# EasyEDA Pro project PicoDucky.epro

# Schematic PicoDucky
Board Name: Board1; Create Date: 2025-05-18; Page Name: P1; Project Name: PicoDucky_V2.0; Schematic Name: PicoDucky; Update Date: 2025-05-29; Company: EasyEDA.com; Page Size: A4; Version: V1.0
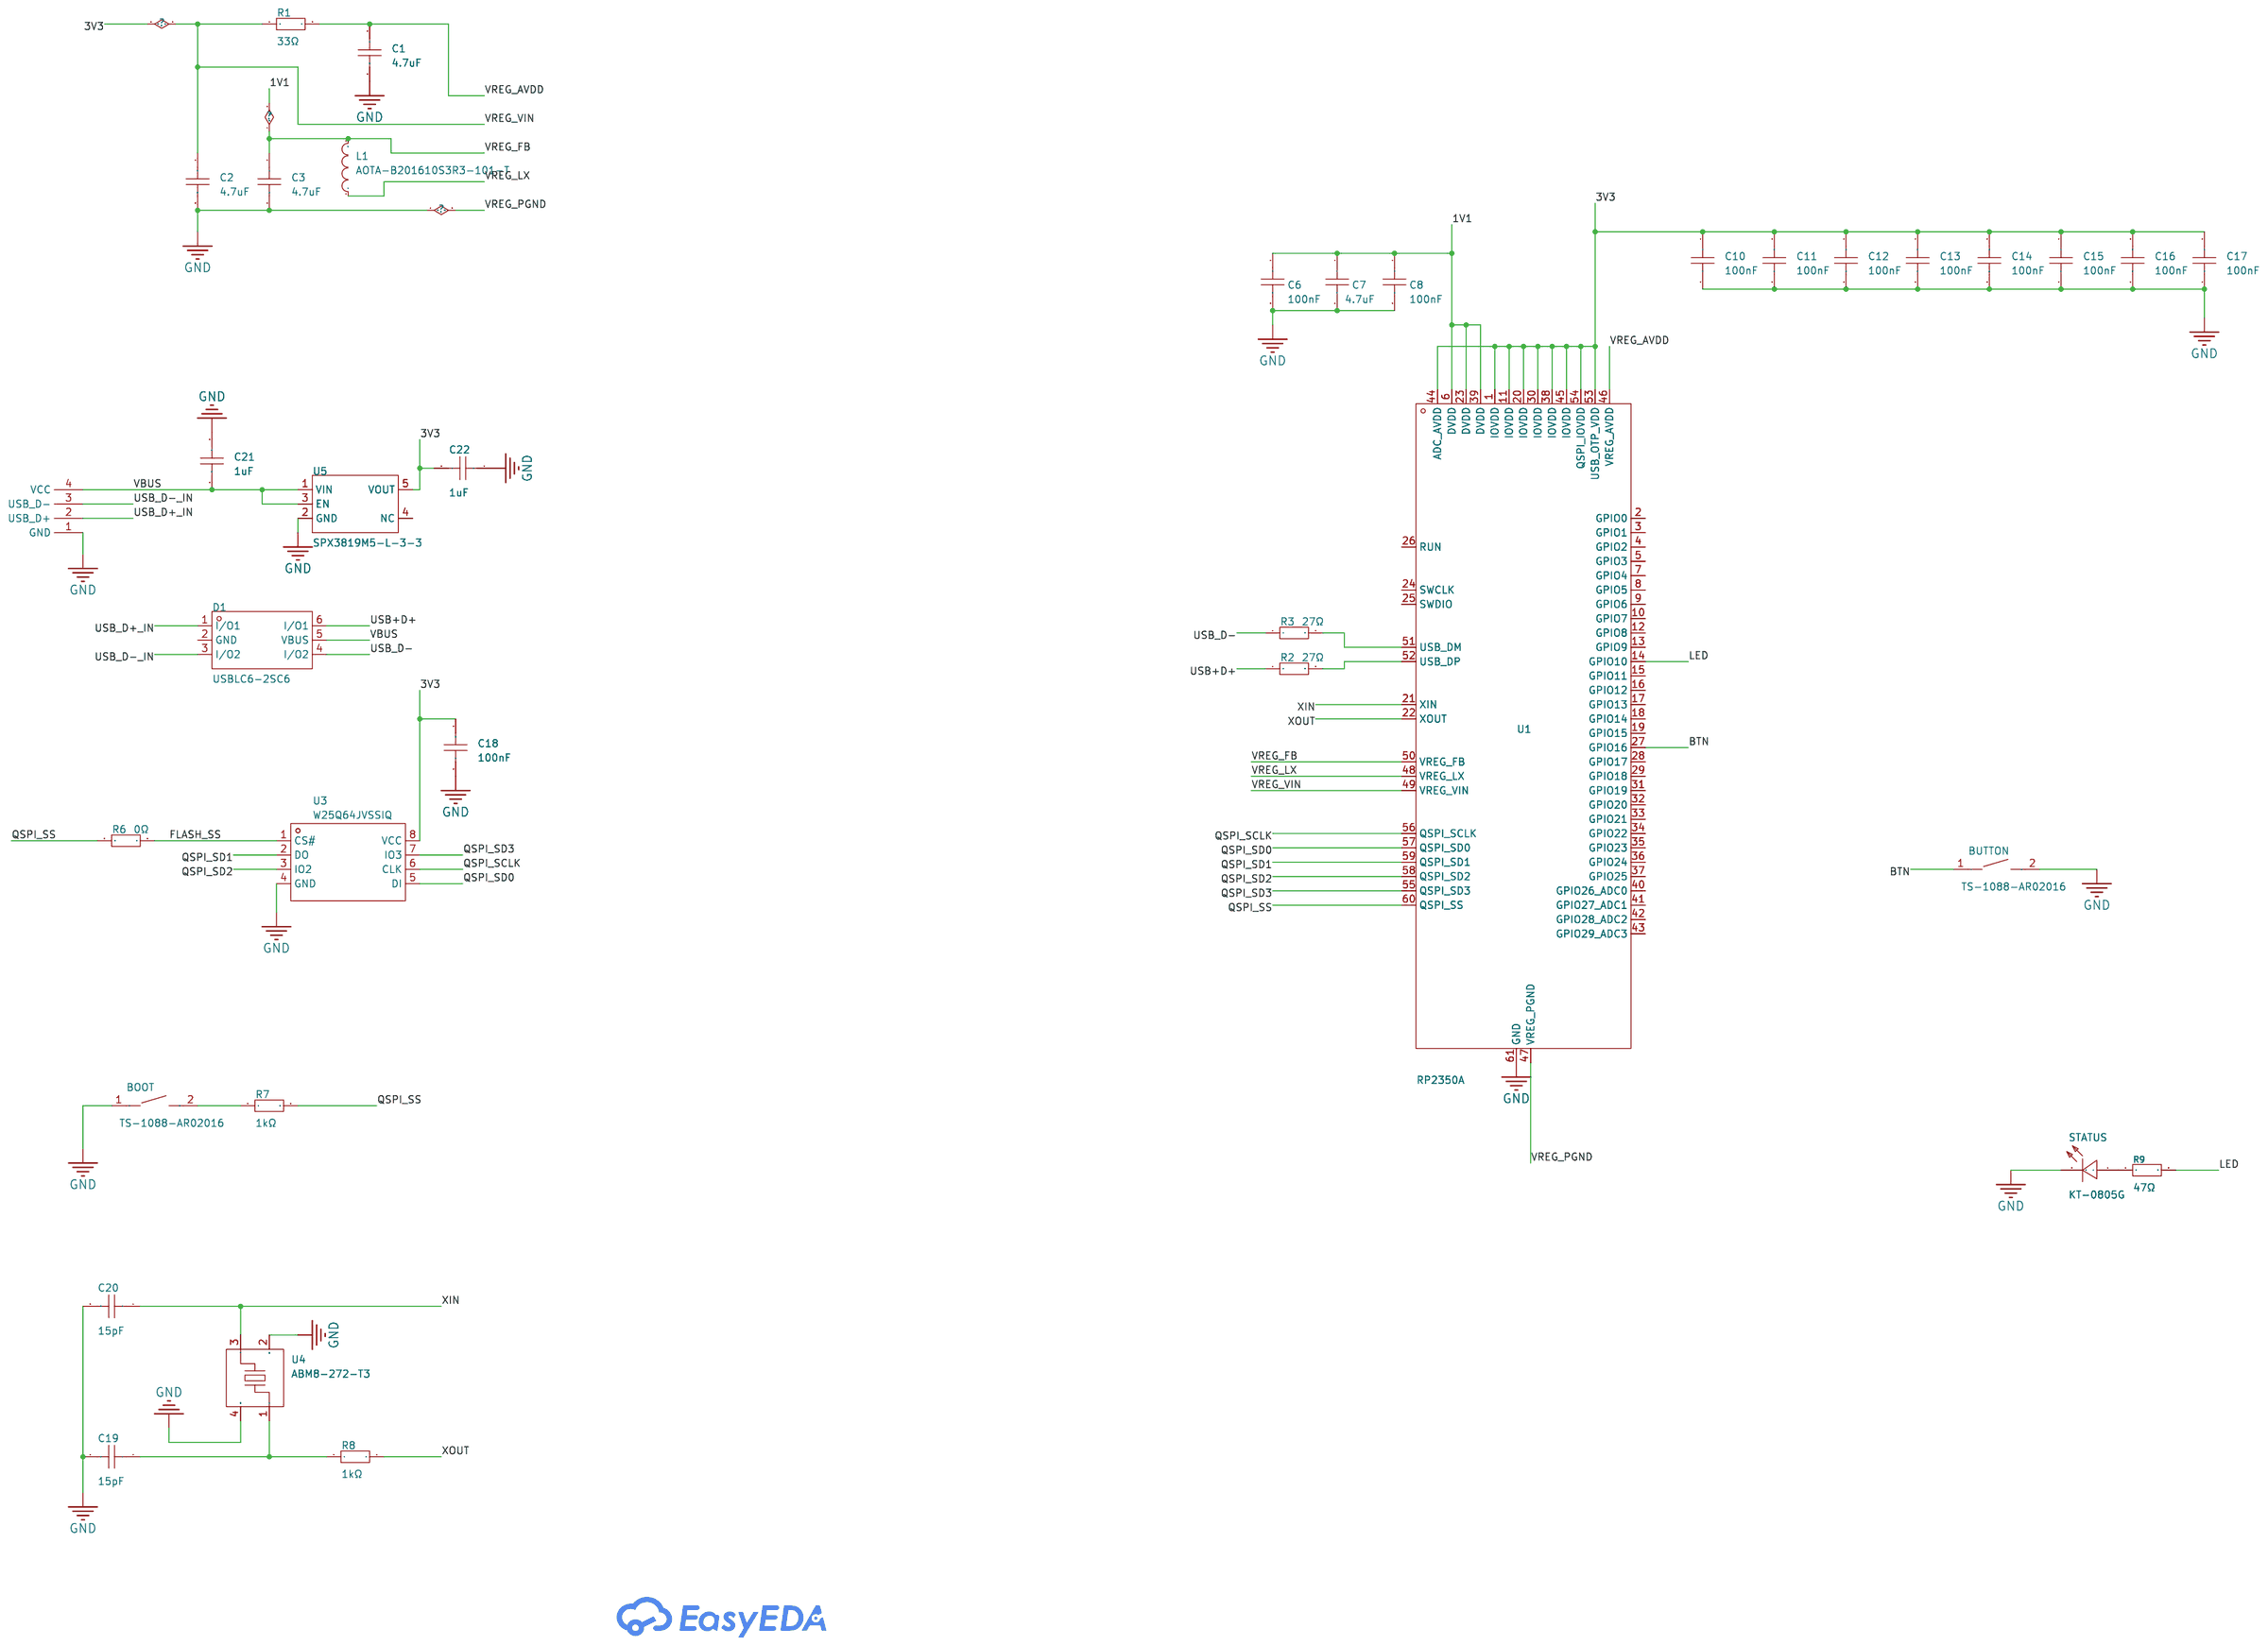
[diagram p0: schematic sheet]

## Parts
BOOT  TS-1088-AR02016  [SW-SMD_L3.9-W3.0-P4.45]
BUTTON  TS-1088-AR02016  [SW-SMD_L3.9-W3.0-P4.45]
C1  4.7uF  [C0402]
C2  4.7uF  [C0402]
C3  4.7uF  [C0402]
C6  100nF  [C0402]
C7  4.7uF  [C0402]
C8  100nF  [C0402]
C10  100nF  [C0402]
C11  100nF  [C0402]
C12  100nF  [C0402]
C13  100nF  [C0402]
C14  100nF  [C0402]
C15  100nF  [C0402]
C16  100nF  [C0402]
C17  100nF  [C0402]
C18  100nF  [C0402]
C19  15pF  [C0402]
C20  15pF  [C0402]
C21  1uF  [C0402]
C22  1uF  [C0402]
D1  USBLC6-2SC6  [SOT-23-6_L2.9-W1.6-P0.95-LS2.8-BL]
L1  AOTA-B201610S3R3-101-T  [IND-SMD_L2.0-W1.6_AOTA-B201610S3R3-101-T]
R1  33Ω  [R0402]
R2  27Ω  [R0402]
R3  27Ω  [R0402]
R6  0Ω  [R0402]
R7  1kΩ  [R0402]
R8  1kΩ  [R0402]
R9  47Ω  [R0603]
STATUS  KT-0805G  [LED0805-R-RD]
U1  RP2350A  [QFN-60_L7.0-W7.0-P0.40-TL-EP3.4]
U3  W25Q64JVSSIQ  [SOP-8_L5.3-W5.3-P1.27-LS8.0-BL]
U4  ABM8-272-T3  [CRYSTAL-SMD_4P-L3.2-W2.5-BL]
U5  SPX3819M5-L-3-3  [SOT-23-5_L3.0-W1.6-P0.95-LS2.8-BR]
X1  -  [USBA_PCB]

## Library data of the parts
BOOT BUTTON = TS-1088-AR02016: Circuit:SPST Actuator Style:Round Button Operating Force:160gf Mounting Style:Brick nogging Switch Length:4mm Switch Width:3mm Switch Height:2mm Strike Gundam:不带 Contact Current:50mA Voltage Rating (DC):12V Insulation Resistance:100MΩ Actuator/Cap Color:B; LCSC Part Name: 4*3*2mm 立贴 轻触开关; Supplier Part: C720477; Manufacturer: XUNPU(讯普); Supplier Footprint: SMD; JLCPCB Part Class: Basic Part; Datasheet: https://atta.szlcsc.com/upload/public/pdf/source/20200810/C720475_60D09DD6C54279ADDB2DC25100F1CC11.pdf; Supplier: LCSC; Circuit: SPST; Actuator Style: Round Button; Operating Force: 160gf; Mounting Style: Brick nogging; Switch Length: 4mm; Switch Width: 3mm; Switch Height: 2mm; Strike Gundam: 不带; Contact Current: 50mA; Voltage Rating (DC): 12V; Insulation Resistance: 100MΩ; Actuator/Cap Color: Black; Pin Style: SMDSplicing; Mechanical Life: 10万次; Operating Temperature: -30℃~+80℃
C1-C3 C7 = CL05A475MP5NRNC: Capacitance: Tolerance:±20% Tolerance:±20% Voltage Rated: Temperature Coefficient:; LCSC Part Name: 4.7uF ±20% 10V; Supplier Part: C23733; Manufacturer: SAMSUNG(三星); Supplier Footprint: 0402; JLCPCB Part Class: Basic Part; Datasheet: https://atta.szlcsc.com/upload/public/pdf/source/20160218/1457707763339.pdf; Supplier: LCSC; Tolerance: ±20%
C6 C8 C10-C18 = CL05B104KO5NNNC: Capacitance: Tolerance:±10% Tolerance:±10% Voltage Rated: Temperature Coefficient:; LCSC Part Name: 100nF ±10% 16V; Supplier Part: C1525; Manufacturer: SAMSUNG(三星); Supplier Footprint: 0402; JLCPCB Part Class: Basic Part; Datasheet: https://atta.szlcsc.com/upload/public/pdf/source/20160218/1457707763339.pdf; Supplier: LCSC; Tolerance: ±10%
C19 C20 = 0402CG150J500NT: Capacitance: Tolerance:±5% Tolerance:±5% Voltage Rated: Temperature Coefficient:; LCSC Part Name: 15pF ±5% 50V; Supplier Part: C1548; Manufacturer: FH(风华); Supplier Footprint: 0402; JLCPCB Part Class: Basic Part; Datasheet: https://atta.szlcsc.com/upload/public/pdf/source/20200305/C486355_26A10D38EF8C2A5C37091D0039909270.pdf; Supplier: LCSC; Tolerance: ±5%
C21 C22 = CL05A105KA5NQNC: Capacitance: Tolerance:±10% Tolerance:±10% Voltage Rated: Temperature Coefficient:; LCSC Part Name: 1uF ±10% 25V; Supplier Part: C52923; Manufacturer: SAMSUNG(三星); Supplier Footprint: 0402; JLCPCB Part Class: Basic Part; Datasheet: https://atta.szlcsc.com/upload/public/pdf/source/20160218/1457707763339.pdf; Supplier: LCSC; Tolerance: ±10%
D1 = USBLC6-2SC6_C2687116: Maximum Clamping Voltage:15V Breakdown Voltage:6V Number of Lines:双路 Type:ESD; Supplier Part: C2687116; Manufacturer: UMW(友台半导体); Supplier Footprint: SOT-23-6; JLCPCB Part Class: Extended Part; Datasheet: https://atta.szlcsc.com/upload/public/pdf/source/20231109/512642D850D9873E7C519F71E85B9A10.pdf; Supplier: LCSC; Maximum Clamping Voltage: 15V; Breakdown Voltage: 6V; Number of Lines: 双路; Type: ESD
L1 = AOTA-B201610S3R3-101-T: Supplier Part: C42411119; Manufacturer: ABRACON; Supplier Footprint: 0806; JLCPCB Part Class: Extended Part; Datasheet: https://atta.szlcsc.com/upload/public/pdf/source/20241210/8ED7235334351200B2CE75E3CBC0DAAD.pdf; Supplier: LCSC
R1 = 0402WGF330JTCE: Type:Thick Film Resistors Resistance:33Ω Tolerance:±1% Tolerance:±1% Power(Watts): Overload Voltage (Max): Temperature Coefficient:±100ppm/℃ Temperature Coefficient:±100ppm/℃ Operating Temperature Range:-55℃~+155℃ Operating Temperature Range:-55℃~+155℃; LCSC Part Name: 33Ω ±1% 62.5mW 厚膜电阻; Supplier Part: C25105; Manufacturer: UNI-ROYAL(厚声); Supplier Footprint: 0402; JLCPCB Part Class: Basic Part; Datasheet: https://atta.szlcsc.com/upload/public/pdf/source/20200306/C422600_1E6D84923E4A46A82E41ADD87F860B5C.pdf; Supplier: LCSC; Type: Thick Film Resistors; Tolerance: ±1%; Temperature Coefficient: ±100ppm/℃; Operating Temperature Range: -55℃~+155℃
R2 R3 = CR0402JF0270G: Type:Thick Film Resistors Resistance: Tolerance:±5% Tolerance:±5% Power(Watts): Overload Voltage (Max): Temperature Coefficient:±200ppm/℃ Temperature Coefficient:±200ppm/℃ Operating Temperature Range:-55℃~+125℃ Operating Temperature Range:-55℃~+125℃; LCSC Part Name: 厚膜电阻 27Ω ±5% 62.5mW; Supplier Part: C100623; Manufacturer: LIZ(丽智电子); Supplier Footprint: 0402; JLCPCB Part Class: Extended Part; Datasheet: https://atta.szlcsc.com/upload/public/pdf/source/20180403/C189438_6D658388CC7843F35BBC9018D03F0B8E.pdf; Supplier: LCSC; Type: Thick Film Resistors; Tolerance: ±5%; Temperature Coefficient: ±200ppm/℃; Operating Temperature Range: -55℃~+125℃
R6 = 0402WGF0000TCE: Type:Thick Film Resistors Resistance: Tolerance:±1% Tolerance:±1% Power(Watts): Overload Voltage (Max): Temperature Coefficient:±800ppm/℃ Temperature Coefficient:±800ppm/℃ Operating Temperature Range:-55℃~+155℃ Operating Temperature Range:-55℃~+155℃; LCSC Part Name: 0Ω ±1% 62.5mW 厚膜电阻; Supplier Part: C17168; Manufacturer: UNI-ROYAL(厚声); Supplier Footprint: 0402; JLCPCB Part Class: Basic Part; Datasheet: https://atta.szlcsc.com/upload/public/pdf/source/20200306/C422600_1E6D84923E4A46A82E41ADD87F860B5C.pdf; Supplier: LCSC; Type: Thick Film Resistors; Tolerance: ±1%; Temperature Coefficient: ±800ppm/℃; Operating Temperature Range: -55℃~+155℃
R7 R8 = 0402WGF1001TCE: Type:Thick Film Resistors Resistance:1kΩ Tolerance:±1% Tolerance:±1% Power(Watts): Overload Voltage (Max): Temperature Coefficient:±100ppm/℃ Temperature Coefficient:±100ppm/℃ Operating Temperature Range:-55℃~+155℃ Operating Temperature Range:-55℃~+155℃; LCSC Part Name: 1kΩ ±1% 62.5mW 厚膜电阻; Supplier Part: C11702; Manufacturer: UNI-ROYAL(厚声); Supplier Footprint: 0402; JLCPCB Part Class: Basic Part; Datasheet: https://atta.szlcsc.com/upload/public/pdf/source/20200306/C422600_1E6D84923E4A46A82E41ADD87F860B5C.pdf; Supplier: LCSC; Type: Thick Film Resistors; Tolerance: ±1%; Temperature Coefficient: ±100ppm/℃; Operating Temperature Range: -55℃~+155℃
R9 = 0603WAF470JT5E: Type:Thick Film Resistors Resistance:47Ω Tolerance:±1% Tolerance:±1% Power(Watts): Overload Voltage (Max): Temperature Coefficient:±100ppm/℃ Temperature Coefficient:±100ppm/℃ Operating Temperature Range:-55℃~+155℃ Operating Temperature Range:-55℃~+155℃; LCSC Part Name: 47Ω ±1% 100mW 厚膜电阻; Supplier Part: C23182; Manufacturer: UNI-ROYAL(厚声); Supplier Footprint: 0603; Datasheet: https://atta.szlcsc.com/upload/public/pdf/source/20200306/C422600_1E6D84923E4A46A82E41ADD87F860B5C.pdf; Supplier: LCSC; Type: Thick Film Resistors; Tolerance: ±1%; Temperature Coefficient: ±100ppm/℃; Operating Temperature Range: -55℃~+155℃
STATUS = KT-0805G: Lamp Holder Type:- Emitted Color:Emerald Forward Voltage (VF):- Forward Voltage (VF):- Power Dissipation:- Forward Current:- Dominant Wavelength:- Dominant Wavelength:- Peak Wavelength:- Diode Configuration:- Lens Color:- Color Temperature:- Color Tempera; LCSC Part Name: 0805 翠绿 高亮; Supplier Part: C2297; Manufacturer: KENTO; Supplier Footprint: 0805; Datasheet: https://atta.szlcsc.com/upload/public/pdf/source/20170209/1486607340485.pdf; Supplier: LCSC; Emitted Color: Emerald
U1 = RP2350A_C42411118: Supplier Part: C42411118; Manufacturer: Raspberry Pi(树莓派); Supplier Footprint: QFN-60-EP(7x7); JLCPCB Part Class: Extended Part; Datasheet: https://atta.szlcsc.com/upload/public/pdf/source/20241210/0989AB86AAD7A21936E5CD12ADC9EA29.pdf; Supplier: LCSC
U3 = W25Q64JVSSIQ_C83140: Interface:SPI Memory Size:- Clock Frequency:133MHz Voltage - Supply:3V~3.6V Voltage - Supply:3V~3.6V Page Programming Time (Tpp):3ms Data Retention - TDR (Year):20 years; Supplier Part: C83140; Manufacturer: WINBOND(华邦); Supplier Footprint: SOP-8-208mil; JLCPCB Part Class: Extended Part; Datasheet: https://atta.szlcsc.com/upload/public/pdf/source/20161110/1478742546019.pdf; Supplier: LCSC; Interface: SPI; Clock Frequency: 133MHz; Voltage - Supply: 3V~3.6V; Page Programming Time (Tpp): 3ms; Data Retention - TDR (Year): 20 years
U4 = ABM8-272-T3_C20625731: Supplier Part: C20625731; Manufacturer: ABRACON; Supplier Footprint: SMD3225-4P; JLCPCB Part Class: Extended Part; Datasheet: https://atta.szlcsc.com/upload/public/pdf/source/20240227/A8BE43F636D80F75C9AF5C59EDF21E9A.pdf; Supplier: LCSC
U5 = SPX3819M5-L-3-3: Output Type:Fixed Voltage - Supply:20V Output Voltage:3.3V Output Voltage:3.3V Output Current:500mA Power Supply Rejection Ratio (PSRR):70dB@(1kHz) Operating Temperature:-40℃~+125℃@(Tj) Operating Temperature:-40℃~+125℃@(Tj) Output Configuration:Positive e; LCSC Part Name: 线性稳压器(LDO); Supplier Part: C20617301; Manufacturer: TECH PUBLIC(台舟); Supplier Footprint: SOT-23-5; JLCPCB Part Class: Extended Part; Datasheet: https://atta.szlcsc.com/upload/public/pdf/source/20240202/40226DC468208A402337870601A95599.pdf; Supplier: LCSC; Output Type: Fixed; Voltage - Supply: 20V; Output Voltage: 3.3V; Output Current: 500mA; Power Supply Rejection Ratio (PSRR): 70dB@(1kHz); Operating Temperature: -40℃~+125℃@(Tj); Output Configuration: Positive electrode; Number of Outputs: 1
X1 = USBA_PCB: USB-A PCB

## Nets
1V1: C3.1 C6.1 C7.1 C8.1 L1.2 U1.6(DVDD) U1.23(DVDD) U1.39(DVDD) U1.50(VREG_FB)
3V3: C2.1 C10.1 C11.1 C12.1 C13.1 C14.1 C15.1 C16.1 C17.1 C18.1 C22.2 R1.1 U1.1(IOVDD) U1.11(IOVDD) U1.20(IOVDD) U1.30(IOVDD) U1.38(IOVDD) U1.44(ADC_AVDD) U1.45(IOVDD) U1.49(VREG_VIN) U1.53(USB_OTP_VDD) U1.54(QSPI_IOVDD) U3.8(VCC) U5.5(VOUT)
GND: BOOT.1 BUTTON.2 C1.2 C2.2 C3.2 C6.2 C7.2 C8.2 C10.2 C11.2 C12.2 C13.2 C14.2 C15.2 C16.2 C17.2 C18.2 C19.2 C20.2 C21.2 C22.1 STATUS.2(K) U1.47(VREG_PGND) U1.61(GND) U3.4(GND) U4.2(GND) U4.4(GND) U5.2(GND) X1.1(GND)
VBUS: C21.1 D1.5(VBUS) U5.1(VIN) U5.3(EN) X1.4(VCC)
BTN: BUTTON.1 U1.27(GPIO16)
FLASH_SS: R6.1 U3.1(CS#)
LED: R9.2 U1.14(GPIO10)
QSPI_SCLK: U1.56(QSPI_SCLK) U3.6(CLK)
QSPI_SD0: U1.57(QSPI_SD0) U3.5(DI)
QSPI_SD1: U1.59(QSPI_SD1) U3.2(DO)
QSPI_SD2: U1.58(QSPI_SD2) U3.3(IO2)
QSPI_SD3: U1.55(QSPI_SD3) U3.7(IO3)
QSPI_SS: R6.2 R7.2 U1.60(QSPI_SS)
USB+D+: D1.6(I/O1) R2.1
USB_D+_IN: D1.1(I/O1) X1.2(USB_D+)
USB_D-: D1.4(I/O2) R3.1
USB_D-_IN: D1.3(I/O2) X1.3(USB_D-)
VREG_AVDD: C1.1 R1.2 U1.46(VREG_AVDD)
VREG_LX: L1.1 U1.48(VREG_LX)
XIN: C20.1 U1.21(XIN) U4.3
XOUT: R8.2 U1.22(XOUT)
$1N5845: R2.2 U1.52(USB_DP)
$1N5851: R3.2 U1.51(USB_DM)
$1N6376: BOOT.2 R7.1
$1N6708: C19.1 R8.1 U4.1
$1N11953: R9.1 STATUS.1(A)

Not connected (* = marked no-connect by the designer): D1 2(GND); U1 2(GPIO0) 3(GPIO1) 4(GPIO2) 5(GPIO3) 7(GPIO4) 8(GPIO5) 9(GPIO6) 10(GPIO7) 12(GPIO8) 13(GPIO9) 15(GPIO11) 16(GPIO12) 17(GPIO13) 18(GPIO14) 19(GPIO15) 24(SWCLK) 25(SWDIO) 26(RUN) 28(GPIO17) 29(GPIO18) 31(GPIO19) 32(GPIO20) 33(GPIO21) 34(GPIO22) 35(GPIO23) 36(GPIO24) 37(GPIO25) 40(GPIO26_ADC0) 41(GPIO27_ADC1) 42(GPIO28_ADC2) 43(GPIO29_ADC3); U5 4(NC)

# Board PCB1
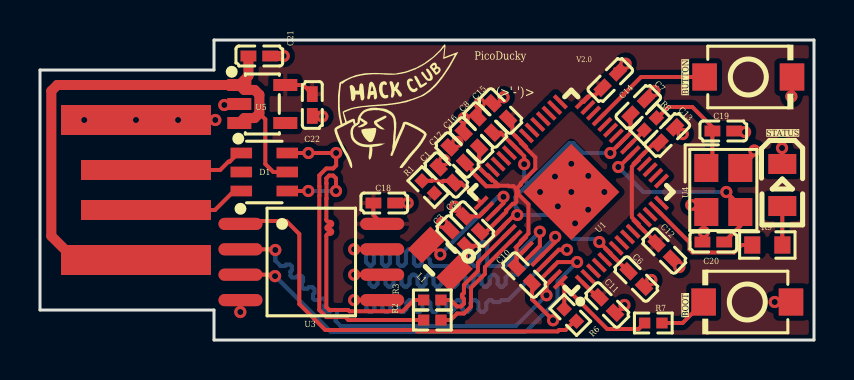
[diagram p1: board, top side]
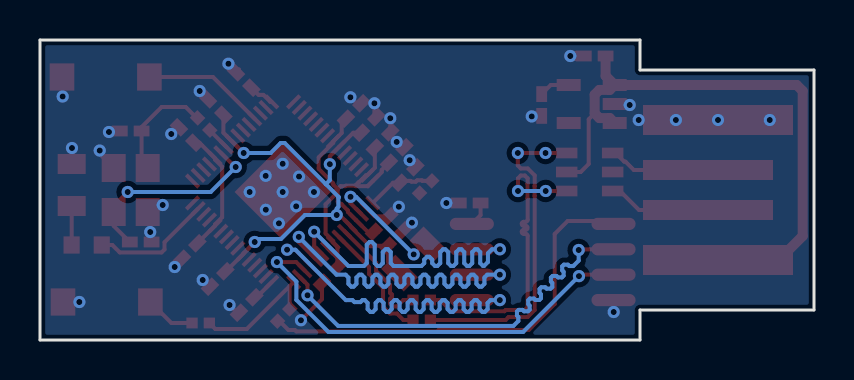
[diagram p2: board, bottom side, seen from below]

Outline 38.7 x 15 mm; copper layers: Top Layer, Bottom Layer. Coordinates in mm from the lower left corner of the outline.
Outline path: 0,13.5 0,1.5 8.7,1.5 8.7,0 38.7,0 38.7,15 8.7,15 8.7,13.5 0,13.5
Stack: Top Layer 0.035mm / Dielectric1 1.51mm FR4 er 4.5 / Bottom Layer 0.035mm

## Design rules (mm)
net USB+D+: DP1
net USB_D-: DP1
net $1N5845: DP2
net $1N5851: DP2
template: Custom Config
spacing copperThickness1oz (default): track to track 0.102, other pairs 0.152 to 0.3
spacing copperThickness2oz: track to track 0.203, other pairs 0.152 to 0.3
track width copperThickness1oz (default): min 0.127, default 0.254, max 2.54
track width copperThickness2oz: min 0.203, default 0.254, max 2.54
differential pair differentialPair (default): width min 0.127, default 0.254, max 2.54; gap min 0.152, default 0.152
via viaSize (default): diameter min 0.5, default 0.61, max 10; hole min 0.3, default 0.305, max 6.3

## Placement (name value [footprint] x y rotation side)
BOOT  TS-1088-AR02016  [SW-SMD_L3.9-W3.0-P4.45]  35.37 1.9 180 top
BUTTON  TS-1088-AR02016  [SW-SMD_L3.9-W3.0-P4.45]  35.42 13.15 0 top
C1  4.7uF  [C0402]  20.32 8.25 135 top
C2  4.7uF  [C0402]  21.62 5.8 135 top
C3  4.7uF  [C0402]  20.92 5.1 135 top
C6  100nF  [C0402]  29.82 3.05 315 top
C7  4.7uF  [C0402]  29.92 11.65 45 top
C8  100nF  [C0402]  22.27 10.75 135 top
C10  100nF  [C0402]  24.22 3.25 315 top
C11  100nF  [C0402]  28.37 1.75 315 top
C12  100nF  [C0402]  31.22 4.45 315 top
C13  100nF  [C0402]  31.37 10.25 45 top
C14  100nF  [C0402]  28.52 13 45 top
C15  100nF  [C0402]  23.02 11.45 135 top
C16  100nF  [C0402]  21.57 10 135 top
C17  100nF  [C0402]  20.87 9.25 135 top
C18  100nF  [C0402]  17.22 6.85 0 top
C19  15pF  [C0402]  34.17 10.45 0 top
C20  15pF  [C0402]  33.67 4.9 180 top
C21  1uF  [C0402]  10.97 14.2 0 top
C22  1uF  [C0402]  13.62 11.75 90 top
D1  USBLC6-2SC6  [SOT-23-6_L2.9-W1.6-P0.95-LS2.8-BL]  11.22 8.4 270 top
L1  AOTA-B201610S3R3-101-T  [IND-SMD_L2.0-W1.6_AOTA-B201610S3R3-101-T]  20.02 4.05 315 top
R1  33Ω  [R0402]  19.42 7.65 135 top
R2  27Ω  [R0402]  19.62 1 0 top
R3  27Ω  [R0402]  19.62 2 0 top
R6  0Ω  [R0402]  26.52 1.25 135 top
R7  1kΩ  [R0402]  30.67 0.85 180 top
R8  1kΩ  [R0402]  30.52 10.8 225 top
R9  47Ω  [R0603]  36.37 4.75 180 top
STATUS  KT-0805G  [LED0805-R-RD]  37.12 7.75 270 top
U1  RP2350A  [QFN-60_L7.0-W7.0-P0.40-TL-EP3.4]  26.57 7.4 135 top
U3  W25Q64JVSSIQ  [SOP-8_L5.3-W5.3-P1.27-LS8.0-BL]  13.57 3.9 270 top
U4  ABM8-272-T3  [CRYSTAL-SMD_4P-L3.2-W2.5-BL]  34.17 7.5 270 top
U5  SPX3819M5-L-3-3  [SOT-23-5_L3.0-W1.6-P0.95-LS2.8-BR]  11.12 11.8 180 top
X1  -  [USBA_PCB]  -0.08 13.85 0 top

## Footprints (pads in the part's own frame, mm; a bottom-side part is the same pattern mirrored in y, then rotated)
C0402
  rect 0.79x0.54 smd: 1(-0.545,0) 2(0.545,0)
CRYSTAL-SMD_4P-L3.2-W2.5-BL
  rect 1.4x1.2 smd: 1(-1.1,-0.85) 2(1.1,-0.85) 3(1.1,0.85) 4(-1.1,0.85)
IND-SMD_L2.0-W1.6_AOTA-B201610S3R3-101-T
  rect 1x1.6 smd: 1(-1,0) 2(1,0)
LED0805-R-RD
  rect 1x1.399 smd: 1(1.05,0) 2(-1.05,0)
QFN-60_L7.0-W7.0-P0.40-TL-EP3.4
  rect 0.875x0.2 smd: 1(-3.575,2.8) 2(-3.575,2.4) 3(-3.575,2) 4(-3.575,1.6) 5(-3.575,1.2) 6(-3.575,0.8) 7(-3.575,0.4) 8(-3.575,0) 9(-3.575,-0.4) 10(-3.575,-0.8) 11(-3.575,-1.2) 12(-3.575,-1.6) 13(-3.575,-2) 14(-3.575,-2.4) 15(-3.575,-2.8) 31(3.575,-2.8) 32(3.575,-2.4) 33(3.575,-2.001) 34(3.575,-1.6) 35(3.575,-1.2) 36(3.575,-0.8) 37(3.575,-0.4) 38(3.575,-0.001) 39(3.575,0.4) 40(3.575,0.8) 41(3.575,1.2) 42(3.575,1.6) 43(3.575,2) 44(3.575,2.4) 45(3.575,2.8)
  rect 0.2x0.875 smd: 16(-2.8,-3.575) 17(-2.4,-3.575) 18(-2,-3.575) 19(-1.6,-3.575) 20(-1.2,-3.575) 21(-0.8,-3.575) 22(-0.4,-3.575) 23(0,-3.575) 24(0.4,-3.575) 25(0.8,-3.575) 26(1.2,-3.575) 27(1.6,-3.575) 28(2,-3.575) 29(2.4,-3.575) 30(2.8,-3.575) 46(2.8,3.575) 47(2.4,3.575) 48(2,3.575) 49(1.6,3.575) 50(1.2,3.575) 51(0.8,3.575) 52(0.4,3.575) 53(0,3.575) 54(-0.4,3.575) 55(-0.8,3.575) 56(-1.2,3.575) 57(-1.6,3.575) 58(-2,3.575) 59(-2.4,3.575) 60(-2.8,3.575)
  rect 3.4x3.4 smd: 61(0,0)
R0402
  rect 0.566x0.54 smd: 1(-0.433,0) 2(0.433,0)
R0603
  rect 0.806x0.864 smd: 1(-0.753,0) 2(0.753,0)
SOP-8_L5.3-W5.3-P1.27-LS8.0-BL
  oval 0.609x2.204 smd: 1(-1.905,-3.542) 2(-0.635,-3.542) 3(0.635,-3.542) 4(1.905,-3.542) 5(1.905,3.542) 6(0.635,3.542) 7(-0.635,3.542) 8(-1.905,3.542)
SOT-23-5_L3.0-W1.6-P0.95-LS2.8-BR
  rect 1.2x0.6 smd: 1(1.15,-0.95) 2(1.15,0) 3(1.15,0.95) 4(-1.15,0.95) 5(-1.15,-0.95)
SOT-23-6_L2.9-W1.6-P0.95-LS2.8-BL
  rect 0.532x1.072 smd: 1(-0.95,-1.149) 2(0,-1.149) 3(0.95,-1.149) 4(0.95,1.149) 5(0,1.149) 6(-0.95,1.149)
SW-SMD_L3.9-W3.0-P4.45
  rect 1.23x1.36 smd: 1(-2.185,0) 2(2.185,0)
USBA_PCB
  rect 7.5x1.5 smd: 1(4.88,-2.85) 4(4.88,-9.85)
  rect 6.5x1 smd: 2(5.38,-5.35) 3(5.38,-7.35)

## Nets
As in the schematic.

Pads without a net: D1 2; U1 2 3 4 5 7 8 9 10 12 13 15 16 17 18 19 24 25 26 28 29 31 32 33 34 35 36 37 40 41 42 43; U5 4

## Via types
v1: diameter 0.61, hole 0.305, Top Layer to Bottom Layer, 61 vias

## Routing (per net, layer and track width the routed paths; a pad name or vN(x,y) marks a point on that pad's centre or on a via; arc(x,y) is an arc through that point)
1V1: length 24.4
  Top Layer w0.2: v1(24.21,8.79) 24.21,9.19 23.04,10.36 22.65,10.36 ; C7.1 29.53,10.36 U1.23 v1(28.52,9.35) ; v1(27.97,4.9) 28.53,4.34 U1.6 29.4,3.44 C6.1 ; 23.19,5.69 22.19,4.69 21.98,4.69 21.96,4.71 C3.1 21.3,3.92 20.72,3.34 ; 23.19,5.72 23.72,6.25 v1(23.87,6.25)
  Bottom Layer w0.2: 24.41,7.79 24.21,7.99 v1(24.21,8.79) ; 24.41,7.79 26.47,9.85 26.67,9.85 27.17,9.35 v1(28.52,9.35) ; 24.41,7.79 23.77,7.15 23.77,7.13 23.78,7.12 23.78,6.66 23.87,6.57 v1(23.87,6.25) 25.45,6.25 26.65,5.05 27.82,5.05 v1(27.97,4.9)
3V3: length 29.8
  Top Layer w0.2: 23.82,7.55 23.82,6.91 23.71,6.81 23.64,6.81 23.31,6.48 23.31,6.41 U1.49 22.32,5.41 C2.1 ; 23.82,7.55 24.04,7.77 24.04,7.83 24.77,8.56 24.77,9.13 24.04,9.86 U1.38 23.62,10.35 23.62,10.85 C15.1 ; 23.82,7.55 23.67,7.69 23.43,7.69 23.4,7.72 22.94,7.72 ; 23.82,7.55 23.91,7.46 23.91,7.3 24.42,6.78 24.42,5.32 24.04,4.94 U1.53 23.83,4.66 23.83,4.1 ; C11.1 27.87,2.14 U1.1 ; 23.83,4.1 U1.54 ; 23.83,4.1 C10.1 ; 22.94,7.72 22.92,7.69 22.31,7.69 U1.45 21.62,8.39 21.62,8.5 21.25,8.86 ; 22.94,7.72 22.78,7.88 22.76,7.88 22.41,8.23 22.34,8.23 21.96,8.61 21.96,9.62 ; C12.1 29.95,5.72 U1.11 29.94,5.79 29.59,6.14 29.59,8.66 29.94,9.01 U1.20 30.73,9.86 C13.1 ; C18.1 16.67,6.24 U3.8 ; C22.2 13.16,12.75 U5.5 ; C14.1 27.77,12.26 27.53,12.26 27.18,11.91 U1.30
GND: length 23.5
  Top Layer w0.2: U4.2 32.92,6.4 v1(32.57,6.75) ; C17.2 20.6,9.64 v1(20.87,9.9) ; 28.75,1.36 28.84,1.36 v1(29.22,1.75) ; C18.2 v1(18.38,6.85) ; v1(36.73,1.9) BOOT.1 ; C15.2 22.88,11.84 v1(23.18,12.14) ; v1(31.97,3.65) 31.6,4.01 C12.2 ; U3.4 10.02,1.41 v1(10.02,1.4) ; v1(35.25,10.4) 34.81,10.4 34.71,10.5 ; 22.34,6.57 21.96,6.19 C2.2 21.23,6.19 v1(20.76,6.66) ; 28.75,13.54 29,13.54 v1(29.28,13.81) ; v1(4.8,11) v1(6.91,11) v1(8.77,11) ; v1(32.14,10.3) 31.8,10.64 31.75,10.64 ; STATUS.2 37.12,9.58 v1(37.1,9.6) ; v1(30.57,3) 30.23,2.66 C6.2 ; C1.2 20.22,8.92 v1(20.22,8.99) ; v1(25.65,0.99) 24.6,2.04 C10.2 ; C16.2 v1(21.19,11.09) ; v1(37.57,12.17) 37.6,12.21 BUTTON.2 ; C8.2 21.98,11.24 v1(21.98,11.84) ; v1(33.19,5.4) 33.19,4.97 C20.2 ; C7.2 v1(30.72,12.45) ; U4.4 35.72,9.3 v1(35.72,9.47) ; v1(20.1,5.87) 20.15,5.87 C3.2
  Top Layer w0.5: C22.1 14.09,11.2 v1(14.11,11.18) ; 11.51,14.2 v1(12.18,14.2)
  vias: v1(2.21,11) v1(9.22,11.75) v1(25,7.4) v1(25.75,8.17) v1(25.89,6.68) v1(26.57,8.81) v1(26.57,7.4) v1(26.75,5.83) v1(27.42,8.21) v1(27.41,6.51) v1(28.22,7.4)
VBUS: length 30.4
  Top Layer w0.2: D1.5 11.67,8.4 11.27,8.8 11.27,11.04 10.97,11.33
  Top Layer w0.5: U5.3 10.21,11.1 10.73,11.1 10.97,11.33 10.97,12.27 10.73,12.5 10.21,12.5 U5.1 ; X1.4 1.77,4 0.57,5.2 0.57,12.45 0.87,12.75 U5.1 ; U5.1 10.42,13.2 C21.1
BTN: length 6.1
  Top Layer w0.2: U1.27 30.05,13.15 BUTTON.1
FLASH_SS: length 21.2
  Top Layer w0.2: 10.27,5.75 10.27,5.85 10.37,5.95 12.32,5.95 12.97,5.3 12.97,1.8 14.27,0.5 18.77,0.5 18.84,0.43 25.88,0.43 25.95,0.5 26.28,0.5 26.72,0.94 R6.1
LED: length 6.1
  Top Layer w0.2: 30.79,6.57 32.47,4.89 32.47,4.53 32.62,4.38 34.71,4.38 35.08,4.75 R9.2
QSPI_SCLK: length 21.5
  Top Layer w0.2: U1.56 25.76,4.9 v1(25.76,5.16) ; U3.6 v1(15.71,3.27)
  Bottom Layer w0.2: v1(15.71,3.27) 16.34,3.27 16.48,3.12 16.48,2.81 16.62,2.67 16.74,2.67 16.88,2.81 16.88,3.12 17.02,3.27 17.14,3.27 17.28,3.12 17.28,2.81 17.42,2.67 17.54,2.67 17.68,2.81 17.68,3.12 17.82,3.27 17.94,3.27 18.08,3.12 18.08,2.81 18.22,2.67 18.34,2.67 18.48,2.81 18.48,3.12 18.62,3.27 18.74,3.27 18.88,3.12 18.88,2.81 19.02,2.67 19.14,2.67 19.28,2.81 19.28,3.12 19.42,3.27 19.54,3.27 19.68,3.12 19.68,2.81 19.82,2.67 19.94,2.67 20.08,2.81 20.08,3.12 20.22,3.27 20.34,3.27 20.48,3.12 20.48,2.81 20.62,2.67 20.74,2.67 20.88,2.81 20.88,3.12 21.02,3.27 21.14,3.27 21.28,3.12 21.28,2.81 21.42,2.67 21.54,2.67 21.68,2.81 21.68,3.12 21.82,3.27 21.94,3.27 22.08,3.12 22.08,2.81 22.22,2.67 22.34,2.67 22.48,2.81 22.48,3.12 22.62,3.27 22.74,3.27 22.88,3.12 22.88,2.81 23.02,2.67 23.14,2.67 23.28,2.81 23.28,3.12 23.42,3.27 23.87,3.27 v1(25.76,5.16)
QSPI_SD0: length 21.5
  Top Layer w0.2: U1.57 25.94,4.51 v1(26.35,4.51) ; U3.5 v1(15.71,1.99)
  Bottom Layer w0.2: v1(15.71,1.99) 16.18,1.99 16.32,1.85 16.32,1.54 16.46,1.4 16.58,1.4 16.72,1.54 16.72,1.85 16.86,1.99 16.98,1.99 17.12,1.85 17.12,1.54 17.26,1.4 17.38,1.4 17.52,1.54 17.52,1.85 17.66,1.99 17.78,1.99 17.92,1.85 17.92,1.54 18.06,1.4 18.18,1.4 18.32,1.54 18.32,1.85 18.46,1.99 18.58,1.99 18.72,1.85 18.72,1.54 18.86,1.4 18.98,1.4 19.12,1.54 19.12,1.85 19.26,1.99 19.38,1.99 19.52,1.85 19.52,1.54 19.66,1.4 19.78,1.4 19.92,1.54 19.92,1.85 20.06,1.99 20.18,1.99 20.32,1.85 20.32,1.54 20.46,1.4 20.58,1.4 20.72,1.54 20.72,1.85 20.86,1.99 20.98,1.99 21.12,1.85 21.12,1.54 21.26,1.4 21.38,1.4 21.52,1.54 21.52,1.85 21.66,1.99 21.78,1.99 21.92,1.85 21.92,1.54 22.06,1.4 22.18,1.4 22.32,1.54 22.32,1.85 22.46,1.99 22.58,1.99 22.68,1.89 22.98,1.89 23.08,1.99 23.41,1.99 25.93,4.51 v1(26.35,4.51)
QSPI_SD1: length 21.1
  Top Layer w0.2: 25.73,3.17 25.33,2.77 v1(25.33,2.24) ; v1(11.77,4.5) 11.73,4.53 U3.2
  Bottom Layer w0.2: v1(11.77,4.5) 11.77,3.97 12.04,3.7 12.24,3.7 12.31,3.77 12.51,3.77 12.59,3.68 12.59,3.48 12.52,3.41 12.52,3.21 12.6,3.13 12.8,3.13 12.87,3.2 13.07,3.2 13.16,3.12 13.16,2.92 13.09,2.85 13.09,2.65 13.17,2.57 13.37,2.57 13.44,2.64 13.64,2.64 13.72,2.55 13.72,2.35 13.65,2.28 13.65,2.08 13.73,2 13.93,2 14,2.07 14.2,2.07 14.29,1.99 14.29,1.79 14.22,1.72 14.22,1.52 14.3,1.43 14.5,1.43 14.57,1.5 14.77,1.5 14.85,1.42 14.85,1.22 14.78,1.15 14.78,0.95 15.03,0.7 23.79,0.7 v1(25.33,2.24)
QSPI_SD2: length 21.6
  Top Layer w0.2: U1.58 25.89,3.9 v1(26.85,3.9) ; v1(11.75,3.19) 11.68,3.27 U3.3
  Bottom Layer w0.2: v1(11.75,3.19) 14.55,0.4 24.28,0.4 25.88,2 25.88,2.92 v1(26.85,3.9)
QSPI_SD3: length 21.3
  Top Layer w0.2: v1(24.99,5.41) 24.99,4.7 U1.55 ; U3.7 v1(15.71,4.53)
  Bottom Layer w0.2: v1(24.99,5.41) 23.28,3.7 22.5,3.7 22.36,3.84 22.36,4.76 22.22,4.9 22.1,4.9 21.96,4.76 21.96,3.84 21.82,3.7 21.7,3.7 21.56,3.84 21.56,4.4 21.42,4.54 21.3,4.54 21.16,4.4 21.16,3.84 21.02,3.7 19.63,3.7 19.49,3.84 19.49,4.02 19.35,4.16 19.23,4.16 19.09,4.02 19.09,3.84 18.95,3.7 18.83,3.7 18.69,3.84 18.69,4.39 18.55,4.53 18.43,4.53 18.29,4.39 18.29,3.84 18.15,3.7 18.03,3.7 17.89,3.84 17.89,4.39 17.75,4.53 17.63,4.53 17.49,4.39 17.49,3.84 17.35,3.7 17.23,3.7 17.09,3.84 17.09,4.39 16.95,4.53 16.83,4.53 16.69,4.39 16.69,3.84 16.55,3.7 16.5,3.7 16.3,3.9 16.3,4.33 16.1,4.53 v1(15.71,4.53)
QSPI_SS: length 6.5
  Top Layer w0.2: 26.21,2.7 26.21,1.56 R6.2 ; 26.21,2.7 U1.60 ; 26.21,2.7 28.36,0.55 29.93,0.55 R7.2 ; 26.21,2.7 26.21,2.7
USB+D+: length 16.3
  Top Layer w0.2: D1.6 v1(13.42,9.35) v1(14.81,9.35) 14.81,8.73 14.66,8.58 14.31,8.58 13.96,8.23 13.96,7.69 13.97,7.68 13.97,7.22 13.96,7.21 13.96,1.5 14.32,1.15 15.27,1.15 15.42,1 19.18,1
USB_D+_IN: length 5.1
  Top Layer w0.2: D1.1 9.92,9.35 9.49,8.92 9.43,8.92 9.01,8.5 X1.2
USB_D-: length 16.1
  Top Layer w0.2: D1.4 v1(13.42,7.45) ; v1(14.8,7.45) 14.8,8.08 14.66,8.22 14.46,8.22 14.32,8.08 14.32,7.83 14.32,7.83 14.32,7.07 14.32,7.07 14.32,6.01 arc(14.35,5.94) 14.42,5.91 14.52,5.91 arc(14.62,5.81) 14.52,5.71 14.42,5.71 arc(14.32,5.61) 14.42,5.51 14.52,5.51 arc(14.62,5.41) 14.52,5.31 14.42,5.31 arc(14.35,5.28) 14.32,5.21 14.32,1.65 14.46,1.5 15.42,1.5 15.48,1.44 18.14,1.44 18.7,2 19.18,2
  Bottom Layer w0.2: v1(13.42,7.45) v1(14.8,7.45)
USB_D-_IN: length 5.2
  Top Layer w0.2: D1.3 10.05,7.45 9.92,7.32 9.57,7.32 8.75,6.5 X1.3
VREG_AVDD: length 3.5
  Top Layer w0.2: U1.46 21.05,7.86 C1.1 20.61,7.96 20.17,7.96 20.12,7.91 19.91,7.91 19.84,7.99 19.61,7.99 19.58,7.96 R1.2
VREG_LX: length 6.4
  Top Layer w0.2: v1(20.02,4.28) 19.49,4.81 19.26,4.81 ; v1(23.17,7.16) 23.17,6.84 U1.48
  Bottom Layer w0.2: v1(20.02,4.28) 22.89,7.16 v1(23.17,7.16)
XIN: length 10.1
  Top Layer w0.2: v1(34.32,7.4) 35.02,6.7 U4.3 35.02,5.7 C20.1 ; v1(28.92,8.65) 28.95,8.65 U1.21
  Bottom Layer w0.2: v1(28.92,8.65) 30.17,7.4 v1(34.32,7.4)
XOUT: length 1.2
  Top Layer w0.2: R8.2 30.21,10.48 29.38,9.64
$1N5845: length 6.2
  Top Layer w0.2: 23.76,5.16 22.25,3.65 22.25,3.3 21.55,2.61 21.55,1.67 21.2,1.32 20.86,1.32 20.53,1 R2.2
$1N5851: length 6
  Top Layer w0.2: R3.2 20.53,2 20.86,1.68 21.06,1.68 21.2,1.82 21.2,2.05 arc(21.18,2.09) 21.15,2.1 arc(21.11,2.12) 21.1,2.15 21.1,2.25 arc(21.11,2.29) 21.15,2.3 arc(21.18,2.32) 21.2,2.35 21.2,2.75 21.89,3.45 21.89,3.86 U1.51
$1N6376: length 2.5
  Top Layer w0.2: R7.1 32.13,0.85 BOOT.2
$1N6708: length 5.6
  Top Layer w0.2: U4.1 33.62,8.91 33.62,10.64 32.62,11.65 31.42,11.65 30.87,11.11 R8.1
$1N11953: length 2
  Top Layer w0.2: R9.1 37.12,4.75 STATUS.1

## Copper pours and planes (outline as drawn; the poured copper is in the pictures)
3V3 on Top Layer: -1.08,15.5 39.52,15.5 39.52,-0.55 -1.08,-0.55
GND on Bottom Layer: -1.18,15.6 39.37,15.6 39.37,-0.5 -1.18,-0.5

## Text on the board
Top Silkscreen Layer: V2.0 | PicoDucky | (>'-')>
